# Altium schematic sheet 副2.SchDoc
size A3
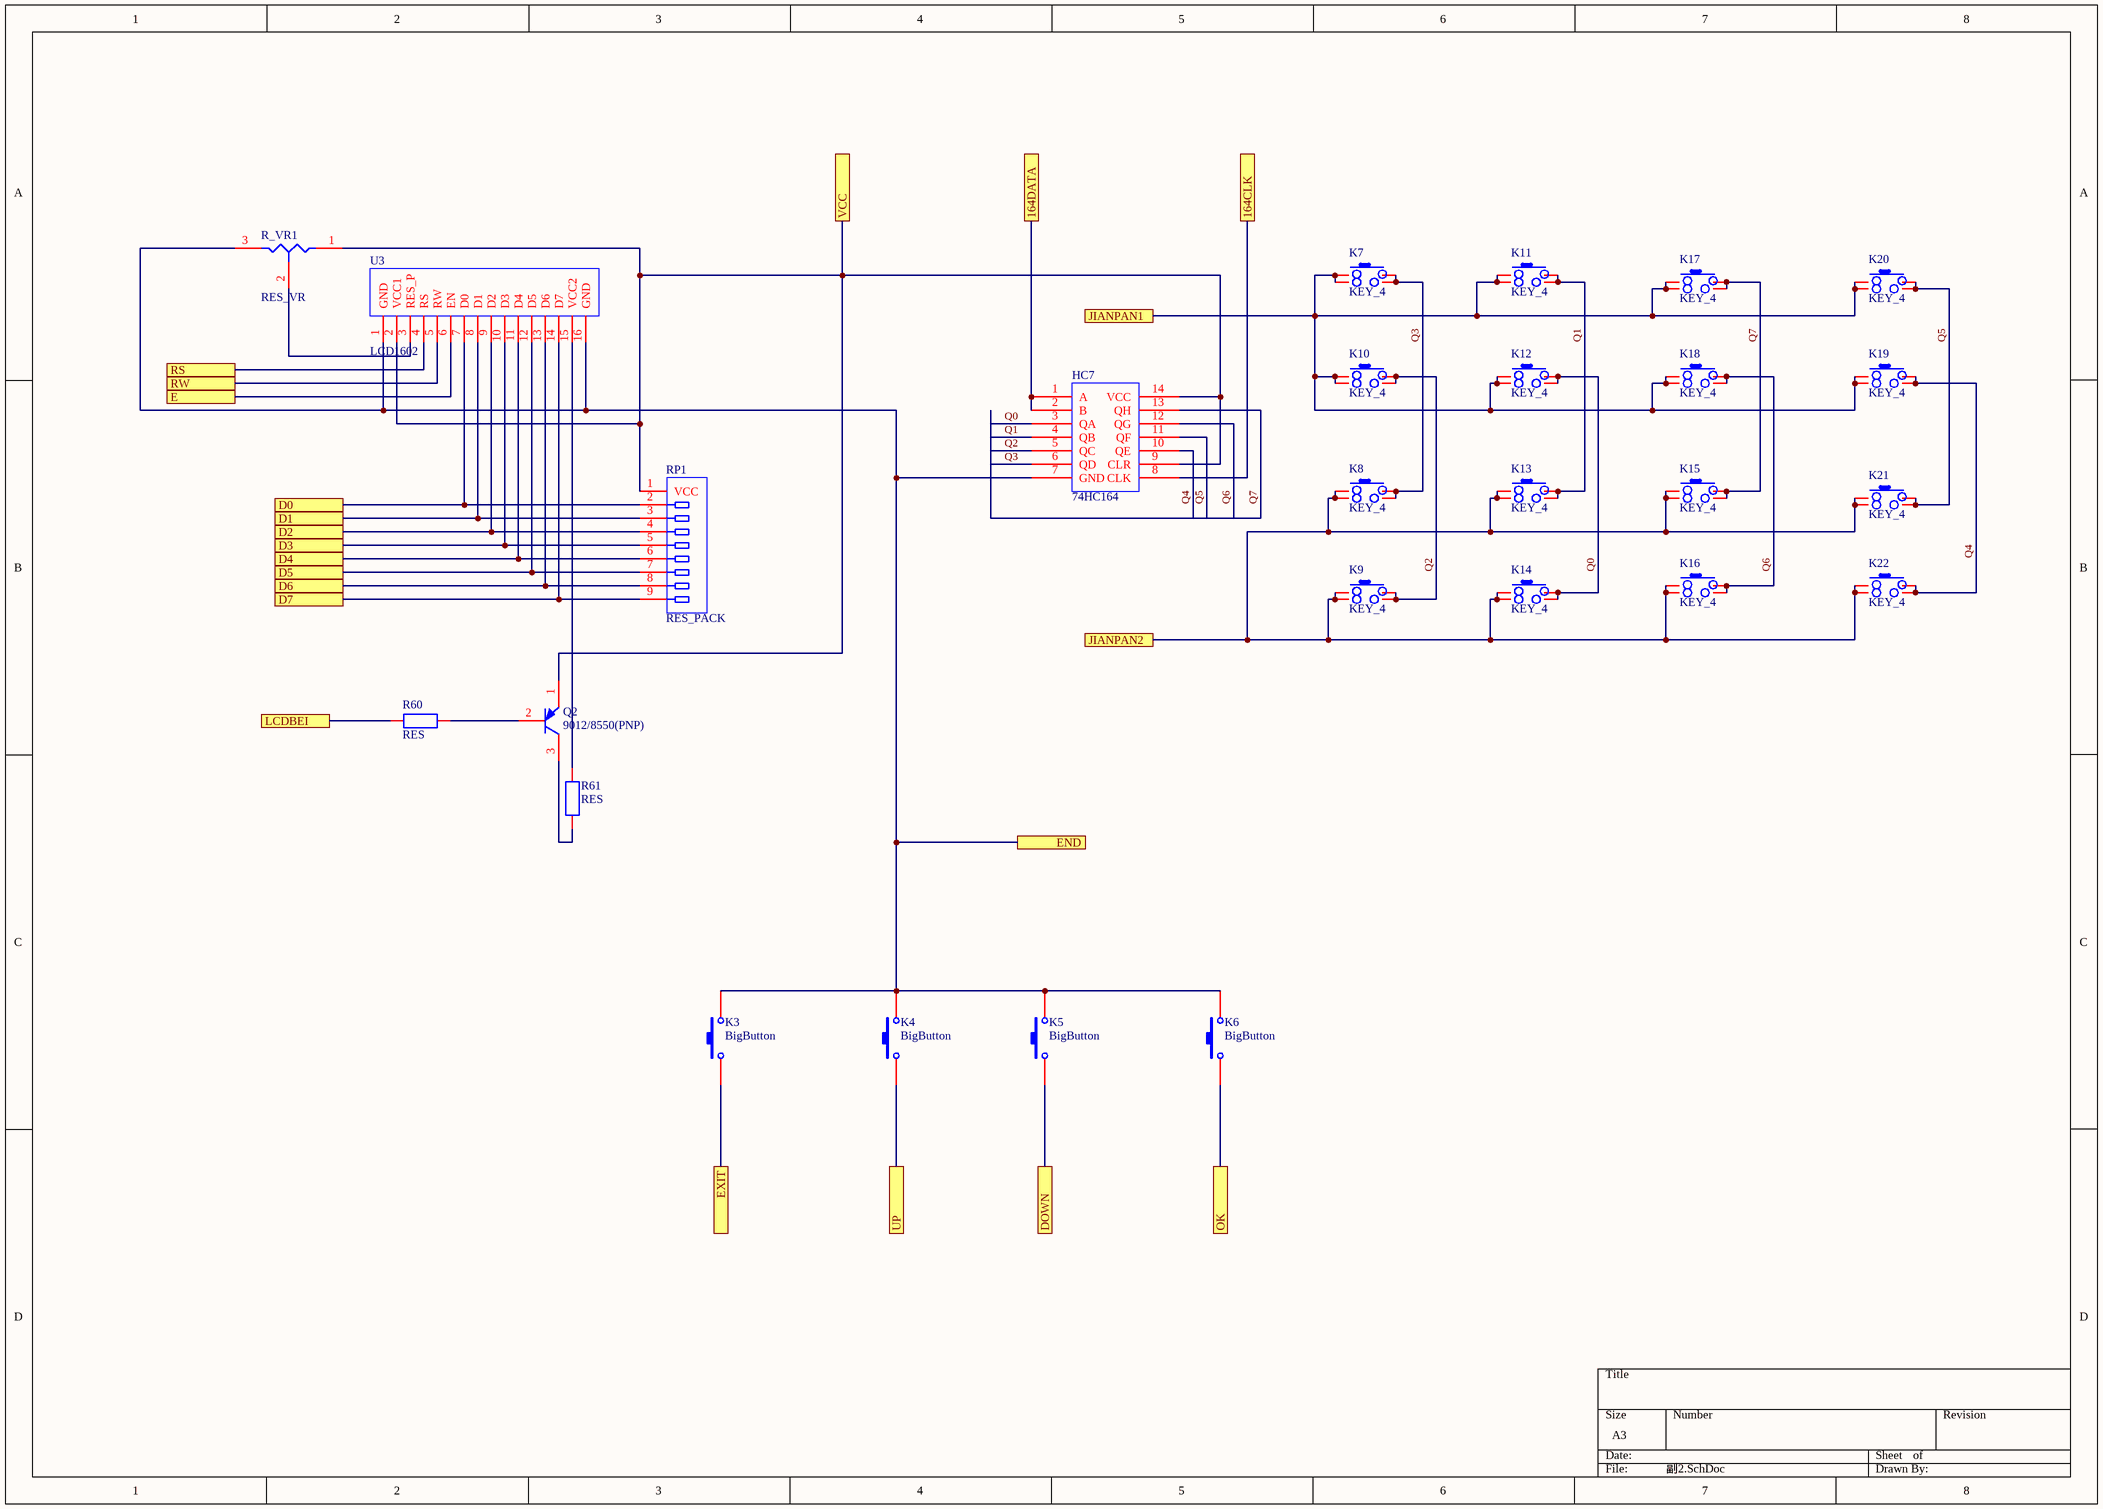
[diagram p0: 副2.SchDoc]

## Parts
HC7  74HC164  [DIP_14]
K3  BigButton  [BigButton]
K4  BigButton  [BigButton]
K5  BigButton  [BigButton]
K6  BigButton  [BigButton]
K7  KEY_4  [KEY_4]
K8  KEY_4  [KEY_4]
K9  KEY_4  [KEY_4]
K10  KEY_4  [KEY_4]
K11  KEY_4  [KEY_4]
K12  KEY_4  [KEY_4]
K13  KEY_4  [KEY_4]
K14  KEY_4  [KEY_4]
K15  KEY_4  [KEY_4]
K16  KEY_4  [KEY_4]
K17  KEY_4  [KEY_4]
K18  KEY_4  [KEY_4]
K19  KEY_4  [KEY_4]
K20  KEY_4  [KEY_4]
K21  KEY_4  [KEY_4]
K22  KEY_4  [KEY_4]
Q2  9012/8550(PNP)  [TO_92]
R60  RES  [RES_DIP]
R61  RES  [RES_DIP]
R_VR1  RES_VR  [RES_VR3296W]
RP1  RES_PACK  [RES_PACK]
U3  LCD1602  [LCD1602]

## Ports
164CLK, 164DATA, D0, D1, D2, D3, D4, D5, D6, D7, DOWN, E, END, EXIT, JIANPAN1, JIANPAN2, LCDBEI, OK, RS, RW, UP, VCC

## Nets
164CLK: HC7.8(CLK) ; port 164CLK
164DATA: HC7.1(A) HC7.2(B) ; port 164DATA
D0: RP1.2 U3.7(D0) ; port D0
D1: RP1.3 U3.8(D1) ; port D1
D2: RP1.4 U3.9(D2) ; port D2
D3: RP1.5 U3.10(D3) ; port D3
D4: RP1.6 U3.11(D4) ; port D4
D5: RP1.7 U3.12(D5) ; port D5
D6: RP1.8 U3.13(D6) ; port D6
D7: RP1.9 U3.14(D7) ; port D7
DOWN: K5.1 ; port DOWN
E: U3.6(EN) ; port E
END: HC7.7(GND) K3.2 K4.2 K5.2 K6.2 R_VR1.3 U3.1(GND) U3.16(GND) ; port END
EXIT: K3.1 ; port EXIT
JIANPAN1: K7.1 K7.2 K10.1 K10.2 K11.1 K11.2 K12.1 K12.2 K17.1 K17.2 K18.1 K18.2 K19.1 K19.2 K20.1 K20.2 ; port JIANPAN1
JIANPAN2: K8.1 K8.2 K9.1 K9.2 K13.1 K13.2 K14.1 K14.2 K15.1 K15.2 K16.1 K16.2 K21.1 K21.2 K22.1 K22.2 ; port JIANPAN2
LCDBEI: R60.1 ; port LCDBEI
OK: K6.1 ; port OK
Q0: HC7.3(QA) K12.3 K12.4 K14.3 K14.4
Q1: HC7.4(QB) K11.3 K11.4 K13.3 K13.4
Q2: HC7.5(QC) K9.3 K9.4 K10.3 K10.4
Q3: HC7.6(QD) K7.3 K7.4 K8.3 K8.4
Q4: HC7.10(QE) K19.3 K19.4 K22.3 K22.4
Q5: HC7.11(QF) K20.3 K20.4 K21.3 K21.4
Q6: HC7.12(QG) K16.3 K16.4 K18.3 K18.4
Q7: HC7.13(QH) K15.3 K15.4 K17.3 K17.4
RS: U3.4(RS) ; port RS
RW: U3.5(RW) ; port RW
UP: K4.1 ; port UP
VCC: HC7.9(CLR) HC7.14(VCC) Q2.1(E) R_VR1.1 RP1.1(VCC) U3.2(VCC1) ; port VCC
NetQ2_2: Q2.2(B) R60.2
NetQ2_3: Q2.3(C) R61.2
NetR61_1: R61.1 U3.15(VCC2)
NetR_VR1_2: R_VR1.2 U3.3(RES_P)

## Library data of the parts
Q2 = 9012/8550(PNP): PNP
R_VR1 = RES_VR: 滑动变阻器